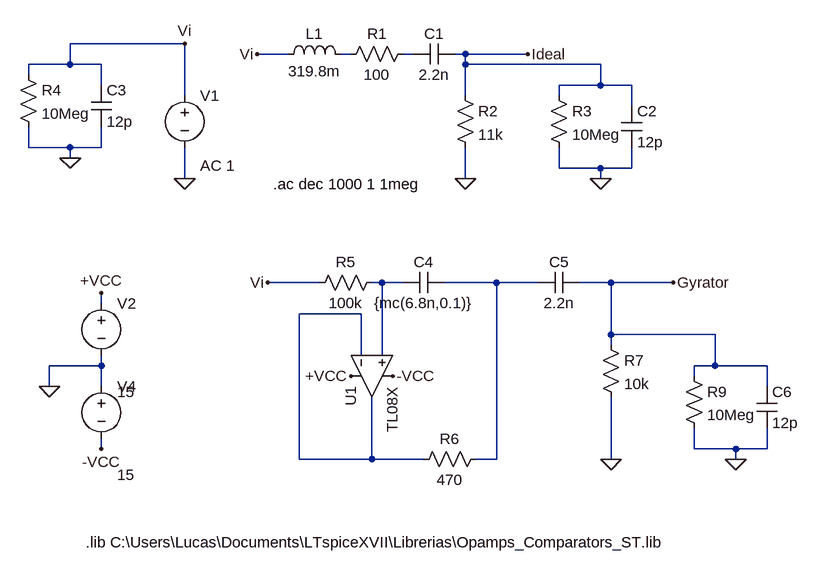
[diagram p0: schematic Pasabanda.asc]
Pasabanda.asc, the LTspice schematic file:
Version 4
SHEET 1 932 816
WIRE -16 32 -192 32
WIRE 144 48 96 48
WIRE 240 48 224 48
WIRE 336 48 320 48
WIRE 416 48 400 48
WIRE 512 48 416 48
WIRE -192 64 -192 32
WIRE -192 64 -256 64
WIRE -144 64 -192 64
WIRE 416 64 416 48
WIRE 624 64 416 64
WIRE -256 80 -256 64
WIRE -144 96 -144 64
WIRE 624 96 624 64
WIRE 624 96 560 96
WIRE 672 96 624 96
WIRE -16 112 -16 32
WIRE 416 112 416 64
WIRE 560 112 560 96
WIRE 672 128 672 96
WIRE -256 192 -256 160
WIRE -192 192 -256 192
WIRE -144 192 -144 160
WIRE -144 192 -192 192
WIRE -192 208 -192 192
WIRE 560 224 560 192
WIRE 624 224 560 224
WIRE 672 224 672 192
WIRE 672 224 624 224
WIRE -16 240 -16 192
WIRE 416 240 416 192
WIRE 624 240 624 224
WIRE 192 400 112 400
WIRE 288 400 272 400
WIRE 320 400 288 400
WIRE 464 400 384 400
WIRE 528 400 464 400
WIRE 640 400 592 400
WIRE 736 400 640 400
WIRE -144 432 -144 416
WIRE 256 448 160 448
WIRE 640 480 640 400
WIRE 800 480 640 480
WIRE 640 496 640 480
WIRE 256 512 256 448
WIRE 288 512 288 400
WIRE -144 528 -144 512
WIRE -144 528 -224 528
WIRE 800 528 800 480
WIRE 800 528 768 528
WIRE 880 528 800 528
WIRE 768 544 768 528
WIRE -224 560 -224 528
WIRE -144 560 -144 528
WIRE 880 560 880 528
WIRE -144 656 -144 640
WIRE 768 656 768 624
WIRE 832 656 768 656
WIRE 880 656 880 624
WIRE 880 656 832 656
WIRE 160 672 160 448
WIRE 272 672 272 576
WIRE 272 672 160 672
WIRE 352 672 272 672
WIRE 464 672 464 400
WIRE 464 672 432 672
WIRE 640 672 640 576
WIRE 832 672 832 656
FLAG -16 32 Vi
FLAG -16 240 0
FLAG 416 240 0
FLAG 96 48 Vi
FLAG 512 48 Ideal
FLAG 624 240 0
FLAG -192 208 0
FLAG 640 672 0
FLAG 112 400 Vi
FLAG 736 400 Gyrator
FLAG -224 560 0
FLAG -144 416 +VCC
FLAG -144 656 -VCC
FLAG 240 544 +VCC
FLAG 304 544 -VCC
FLAG 832 672 0
SYMBOL voltage -16 96 R0
WINDOW 123 24 124 Left 2
WINDOW 39 0 0 Left 0
SYMATTR Value2 AC 1
SYMATTR InstName V1
SYMATTR Value ""
SYMBOL ind 128 64 R270
WINDOW 0 32 56 VTop 2
WINDOW 3 5 56 VBottom 2
SYMATTR InstName L1
SYMATTR Value 319.8m
SYMBOL res 336 32 R90
WINDOW 0 0 56 VBottom 2
WINDOW 3 32 56 VTop 2
SYMATTR InstName R1
SYMATTR Value 100
SYMBOL cap 400 32 R90
WINDOW 0 0 32 VBottom 2
WINDOW 3 32 32 VTop 2
SYMATTR InstName C1
SYMATTR Value 2.2n
SYMBOL res 400 96 R0
SYMATTR InstName R2
SYMATTR Value 11k
SYMBOL res 544 96 R0
SYMATTR InstName R3
SYMATTR Value 10Meg
SYMBOL cap 656 128 R0
SYMATTR InstName C2
SYMATTR Value 12p
SYMBOL res -272 64 R0
SYMATTR InstName R4
SYMATTR Value 10Meg
SYMBOL cap -160 96 R0
SYMATTR InstName C3
SYMATTR Value 12p
SYMBOL res 288 384 R90
WINDOW 0 0 56 VBottom 2
WINDOW 3 32 56 VTop 2
SYMATTR InstName R5
SYMATTR Value 100k
SYMBOL cap 384 384 R90
WINDOW 0 0 32 VBottom 2
WINDOW 3 32 32 VTop 2
SYMATTR InstName C4
SYMATTR Value {mc(6.8n,0.1)}
SYMBOL cap 592 384 R90
WINDOW 0 0 32 VBottom 2
WINDOW 3 32 32 VTop 2
SYMATTR InstName C5
SYMATTR Value 2.2n
SYMBOL Opamps\\opamp2 208 544 M90
SYMATTR InstName U1
SYMATTR Value TL08X
SYMBOL res 448 656 R90
WINDOW 0 0 56 VBottom 2
WINDOW 3 32 56 VTop 2
SYMATTR InstName R6
SYMATTR Value 470
SYMBOL res 624 480 R0
SYMATTR InstName R7
SYMATTR Value 10k
SYMBOL voltage -144 416 R0
WINDOW 3 24 152 Left 2
WINDOW 123 24 124 Left 2
WINDOW 39 0 0 Left 0
SYMATTR Value 15
SYMATTR InstName V2
SYMBOL voltage -144 544 R0
WINDOW 3 24 152 Left 2
WINDOW 123 24 124 Left 2
WINDOW 39 0 0 Left 0
SYMATTR Value 15
SYMATTR InstName V4
SYMBOL res 752 528 R0
SYMATTR InstName R9
SYMATTR Value 10Meg
SYMBOL cap 864 560 R0
SYMATTR InstName C6
SYMATTR Value 12p
TEXT 120 248 Left 2 !.ac dec 1000 1 1meg
TEXT -168 800 Left 2 !.lib C:\\Users\\Lucas\\Documents\\LTspiceXVII\\Librerias\\Opamps_Comparators_ST.lib

The netlist it stands for:
* Pasabanda.asc
V1 Vi 0 AC 1
L1 Vi N001 319.8m
R1 N002 N001 100
C1 Ideal N002 2.2n
R2 Ideal 0 11k
R3 Ideal 0 10Meg
C2 Ideal 0 12p
R4 Vi 0 10Meg
C3 Vi 0 12p
R5 N003 Vi 100k
C4 N004 N003 {mc(6.8n,0.1)}
C5 Gyrator N004 2.2n
XU1 N003 N005 +VCC -VCC N005 TL08X  ; pins In+ In- V+ V- OUT
R6 N004 N005 470
R7 Gyrator 0 10k
V2 +VCC 0 15
V4 0 -VCC 15
R9 Gyrator 0 10Meg
C6 Gyrator 0 12p
.ac dec 1000 1 1meg
.lib C:\Users\Lucas\Documents\LTspiceXVII\Librerias\Opamps_Comparators_ST.lib
.backanno
.end